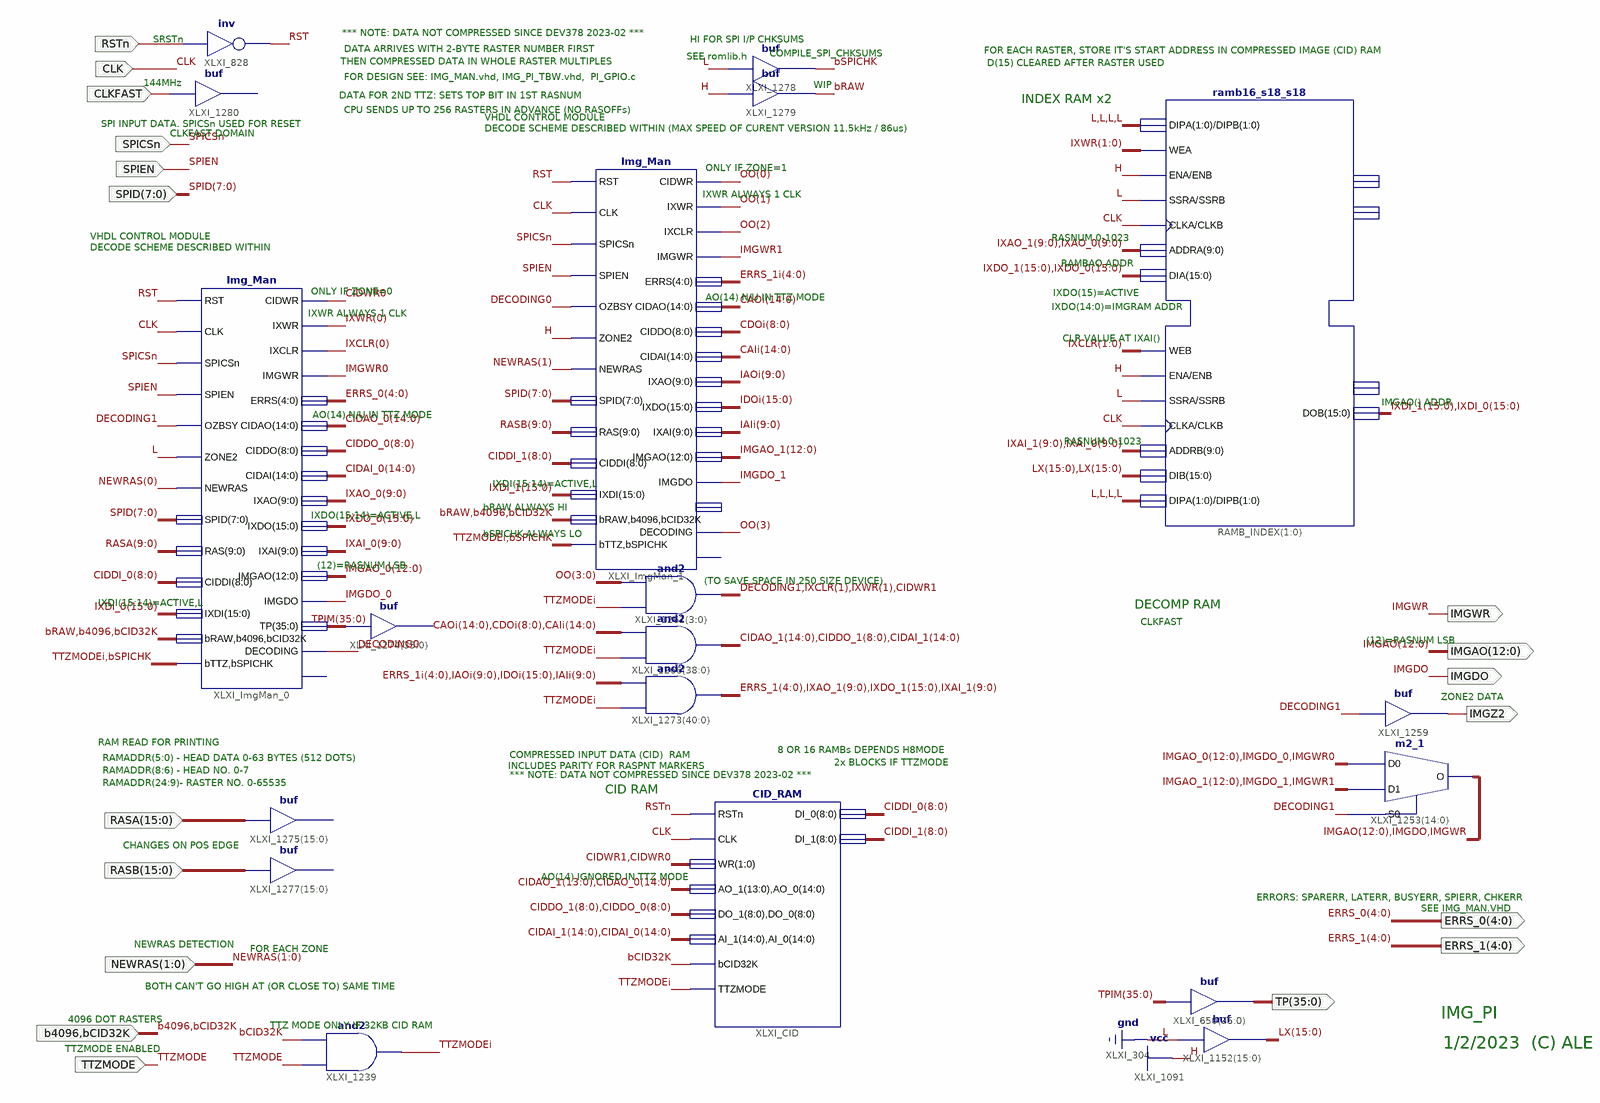
[diagram p0: schematic sheet 1]
// Xilinx ISE schematic Img_Pi.sch (spartan6) as structural Verilog: 19 symbols, 18 ports
module Img_Pi (
  input  SPICSn,
  input  CLK,
  input  SPIEN,
  input  [7:0] SPID,
  input  RSTn,
  input  [15:0] RASA,
  input  [1:0] NEWRAS,
  input  TTZMODE,
  input  [15:0] RASB,
  input  CLKFAST,
  input  b4096,
  input  bCID32K,
  output [35:0] TP,
  output IMGWR,
  output [12:0] IMGAO,
  output IMGDO,
  output IMGZ2,
  output [4:0] ERRS_1,
  output [4:0] ERRS_0
);

  wire bRAW, bSPICHK, CIDWR0, CIDWR1, DECODING0, DECODING1, IMGDO_0, IMGDO_1, IMGWR0, IMGWR1, RST, TTZMODEi;
  wire [1:0] IXCLR, IXWR;
  wire [3:0] OO;
  wire [4:0] ERRS_1i;
  wire [8:0] CDOi, CIDDI_0, CIDDI_1, CIDDO_0, CIDDO_1;
  wire [9:0] IAIi, IAOi, IXAI_0, IXAI_1, IXAO_0, IXAO_1;
  wire [12:0] IMGAO_0, IMGAO_1;
  wire [14:0] CAIi, CAOi, CIDAI_0, CIDAI_1, CIDAO_0, CIDAO_1;
  wire [15:0] IDOi, IXDI_0, IXDI_1, IXDO_0, IXDO_1, LX;
  wire [35:0] TPIM;

  not XLXI_828 (RST, RSTn);
  assign LX = {16{1'b0}};  // buf XLXI_1152[15..0], 16 bits wide
  assign TP = TPIM;  // buf XLXI_650[35..0], 36 bits wide
  CID_RAM XLXI_CID (
    .AI_1(CIDAI_1), .AI_0(CIDAI_0), .AO_1(CIDAO_1[13:0]), .AO_0(CIDAO_0), .CLK(CLK), .DI_0(CIDDI_0),
    .DI_1(CIDDI_1), .DO_1(CIDDO_1), .DO_0(CIDDO_0), .bCID32K(bCID32K), .RSTn(RSTn), .TTZMODE(TTZMODEi),
    .WR({CIDWR1, CIDWR0}));
  and XLXI_1239 (TTZMODEi, TTZMODE, bCID32K);
  Img_Man XLXI_ImgMan_0 (
    .RST(RST), .CLK(CLK), .SPICSn(SPICSn), .SPIEN(SPIEN), .ZONE2(1'b0), .NEWRAS(NEWRAS[0]),
    .OZBSY(DECODING1), .SPID(SPID), .RAS(RASA[9:0]), .CIDDI(CIDDI_0), .IXDI(IXDI_0), .CIDWR(CIDWR0),
    .IXWR(IXWR[0]), .IXCLR(IXCLR[0]), .IMGWR(IMGWR0), .IMGDO(IMGDO_0), .DECODING(DECODING0), .ERRS(ERRS_0),
    .CIDAO(CIDAO_0), .CIDDO(CIDDO_0), .CIDAI(CIDAI_0), .IXAO(IXAO_0), .IXDO(IXDO_0), .IXAI(IXAI_0),
    .IMGAO(IMGAO_0), .TP(TPIM), .bRAW(bRAW), .b4096(b4096), .bCID32K(bCID32K), .bTTZ(TTZMODEi),
    .bSPICHK(bSPICHK));  // open: ANYERR
  m2_1 XLXI_1253[14:0] (
    .D0({IMGAO_0, IMGDO_0, IMGWR0}), .D1({IMGAO_1, IMGDO_1, IMGWR1}), .S0(DECODING1),
    .O({IMGAO, IMGDO, IMGWR}));
  buf XLXI_1259 (IMGZ2, DECODING1);
  Img_Man XLXI_ImgMan_1 (
    .RST(RST), .CLK(CLK), .SPICSn(SPICSn), .SPIEN(SPIEN), .ZONE2(1'b1), .NEWRAS(NEWRAS[1]),
    .OZBSY(DECODING0), .SPID(SPID), .RAS(RASB[9:0]), .CIDDI(CIDDI_1), .IXDI(IXDI_1), .CIDWR(OO[0]),
    .IXWR(OO[1]), .IXCLR(OO[2]), .IMGWR(IMGWR1), .IMGDO(IMGDO_1), .DECODING(OO[3]), .ERRS(ERRS_1i),
    .CIDAO(CAOi), .CIDDO(CDOi), .CIDAI(CAIi), .IXAO(IAOi), .IXDO(IDOi), .IXAI(IAIi), .IMGAO(IMGAO_1),
    .bRAW(bRAW), .b4096(b4096), .bCID32K(bCID32K), .bTTZ(TTZMODEi), .bSPICHK(bSPICHK));  // open: TP, ANYERR
  ramb16_s18_s18 RAMB_INDEX[1:0] (
    .ADDRA({IXAO_1, IXAO_0}), .ADDRB({IXAI_1, IXAI_0}), .CLKA(CLK), .CLKB(CLK), .DIA({IXDO_1, IXDO_0}),
    .DIB({LX, LX}), .DIPA(4'b0000), .DIPB(4'b0000), .ENA(1'b1), .ENB(1'b1), .SSRA(1'b0), .SSRB(1'b0),
    .WEA(IXWR), .WEB(IXCLR), .DOB({IXDI_1, IXDI_0}));  // open: DOA, DOPA, DOPB
  // buf XLXI_1274[35..0] has open pins: I=TPIM, O=open
  assign {DECODING1, IXCLR[1], IXWR[1], CIDWR1} = {4{TTZMODEi}} & OO;  // and2 XLXI_1262[3..0], 4 bits wide
  assign {CIDAO_1, CIDDO_1, CIDAI_1} = {39{TTZMODEi}} & {CAOi, CDOi, CAIi};  // and2 XLXI_1266[38..0], 39 bits wide
  assign {ERRS_1, IXAO_1, IXDO_1, IXAI_1} = {41{TTZMODEi}} & {ERRS_1i, IAOi, IDOi, IAIi};  // and2 XLXI_1273[40..0], 41 bits wide
  // buf XLXI_1275[15..0] has open pins: I=RASA, O=open
  // buf XLXI_1277[15..0] has open pins: I=RASB, O=open
  buf XLXI_1278 (bSPICHK, 1'b0);
  buf XLXI_1279 (bRAW, 1'b1);
  // buf XLXI_1280 has open pins: I=CLKFAST, O=open

  // Notes on the sheet:
  //   *** NOTE: DATA NOT COMPRESSED SINCE DEV378 2023-02 ***
  //   SRSTn
  //   HI FOR SPI I/P CHKSUMS
  //   DATA ARRIVES WITH 2-BYTE RASTER NUMBER FIRST
  //   FOR EACH RASTER, STORE IT'S START ADDRESS IN COMPRESSED IMAGE (CID) RAM
  //   COMPILE_SPI_CHKSUMS
  //   SEE romlib.h
  //   THEN COMPRESSED DATA IN WHOLE RASTER MULTIPLES
  //   D(15) CLEARED AFTER RASTER USED
  //   FOR DESIGN SEE: IMG_MAN.vhd, IMG_PI_TBW.vhd,  PI_GPIO.c
  //   144MHz
  //   WIP
  //   DATA FOR 2ND TTZ: SETS TOP BIT IN 1ST RASNUM
  //   INDEX RAM x2
  //   CPU SENDS UP TO 256 RASTERS IN ADVANCE (NO RASOFFs)
  //   VHDL CONTROL MODULE
  //   SPI INPUT DATA. SPICSn USED FOR RESET
  //   DECODE SCHEME DESCRIBED WITHIN (MAX SPEED OF CURENT VERSION 11.5kHz / 86us)
  //   CLKFAST DOMAIN
  //   ONLY IF ZONE=1
  //   IXWR ALWAYS 1 CLK
  //   VHDL CONTROL MODULE
  //   RASNUM 0-1023
  //   DECODE SCHEME DESCRIBED WITHIN
  //   RAMBAO ADDR
  //   ONLY IF ZONE=0
  //   IXDO(15)=ACTIVE
  //   AO(14) N/U IN TTZ MODE
  //   IXDO(14:0)=IMGRAM ADDR
  //   IXWR ALWAYS 1 CLK
  //   CLR VALUE AT IXAI()
  //   IMGAO() ADDR
  //   AO(14) N/U IN TTZ MODE
  //   RASNUM 0-1023
  //   IXDI(15:14)=ACTIVE,L
  //   bRAW ALWAYS HI
  //   IXDO(15:14)=ACTIVE,L
  //   bSPICHK ALWAYS LO
  //   (12)=RASNUM LSB
  //   (TO SAVE SPACE IN 250 SIZE DEVICE)
  //   IXDI(15:14)=ACTIVE,L
  //   DECOMP RAM
  //   CLKFAST
  //   (12)=RASNUM LSB
  //   ZONE2 DATA
  //   RAM READ FOR PRINTING
  //   8 OR 16 RAMBs DEPENDS H8MODE
  //   COMPRESSED INPUT DATA (CID)  RAM
  //   RAMADDR(5:0) - HEAD DATA 0-63 BYTES (512 DOTS)
  //   2x BLOCKS IF TTZMODE
  //   INCLUDES PARITY FOR RASPNT MARKERS
  //   RAMADDR(8:6) - HEAD NO. 0-7
  //   *** NOTE: DATA NOT COMPRESSED SINCE DEV378 2023-02 ***
  //   RAMADDR(24:9)- RASTER NO. 0-65535
  //   CID RAM
  //   CHANGES ON POS EDGE
  //   AO(14) IGNORED IN TTZ MODE
  //   ERRORS: SPARERR, LATERR, BUSYERR, SPIERR, CHKERR
  //   SEE IMG_MAN.VHD
  //   NEWRAS DETECTION
  //   FOR EACH ZONE
  //   BOTH CAN'T GO HIGH AT (OR CLOSE TO) SAME TIME
  //   IMG_PI
  //   4096 DOT RASTERS
  //   TTZ MODE ONLY IF 32KB CID RAM
  //   1/2/2023  (C) ALE
  //   TTZMODE ENABLED
endmodule
